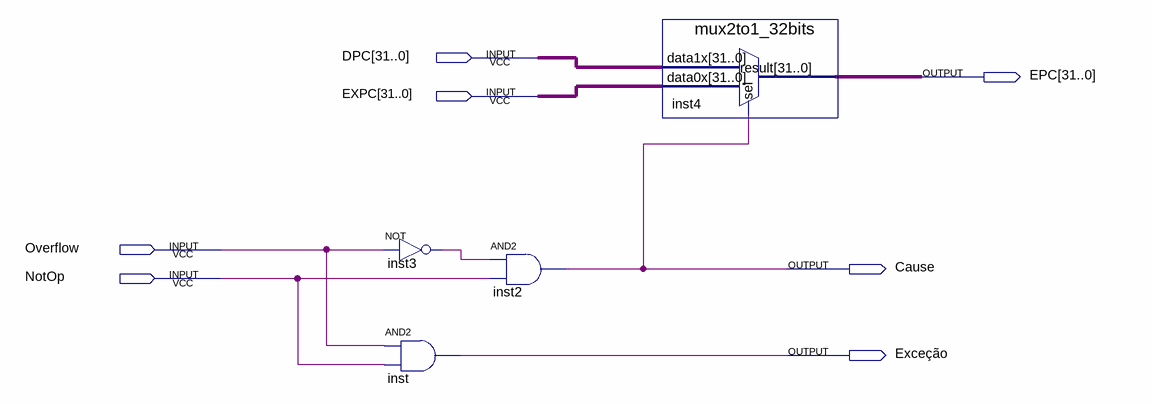
[diagram p0: schematic sheet]
// Quartus schematic ControleExececao.bdf as structural Verilog: 4 symbols, 7 pins
module ControleExececao (
  input  [31:0] DPC,
  input  [31:0] EXPC,
  input  Overflow,
  input  NotOp,
  output [31:0] EPC,
  output Cause,
  output \Exceção 
);

  wire inst3_out;

  not inst3 (inst3_out, Overflow);
  and inst (\Exceção , Overflow, NotOp);
  and inst2 (Cause, inst3_out, NotOp);
  mux2to1_32bits inst4 (.data1x(DPC), .data0x(EXPC), .sel(Cause), .result(EPC));
endmodule
